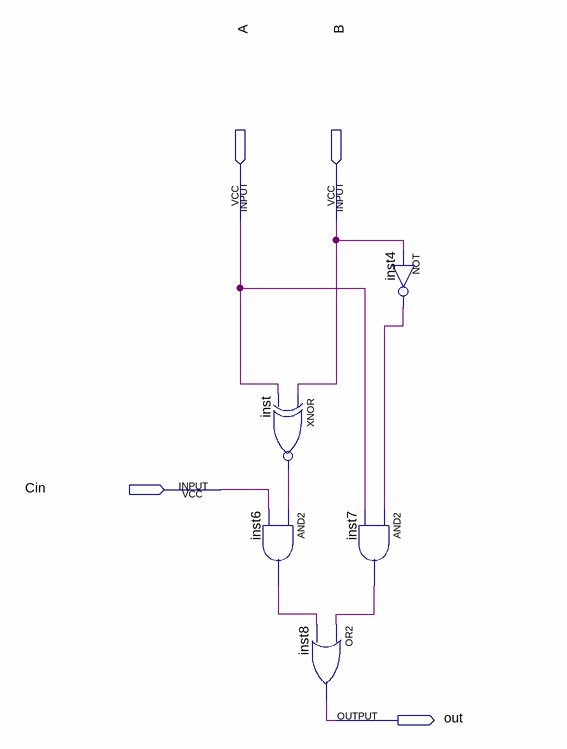
[diagram p0: schematic sheet]
// Quartus schematic MaiorBit.bdf as structural Verilog: 5 symbols, 4 pins
module MaiorBit (
  input  A,
  input  B,
  input  Cin,
  output out
);

  wire inst4_out, inst6_out, inst7_out, inst_out;

  xnor inst (inst_out, B, A);
  and inst6 (inst6_out, inst_out, Cin);
  or inst8 (out, inst7_out, inst6_out);
  and inst7 (inst7_out, inst4_out, A);
  not inst4 (inst4_out, B);
endmodule
